# Altium schematic sheet IMU_breakout.SchDoc
size A4
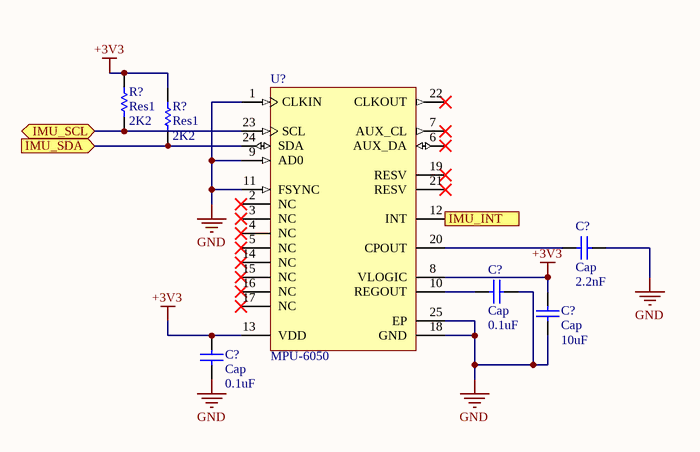
[diagram p0: IMU_breakout.SchDoc]

## Parts
(Parts that share a designator on the sheet are numbered #1, #2 ... from top to bottom, then left to right.)
C?#1  Cap  value 2.2nF  [RAD-0.3]
C?#2  Cap  value 0.1uF  [RAD-0.3]
C?#3  Cap  value 10uF  [RAD-0.3]
C?#4  Cap  value 0.1uF  [RAD-0.3]
R?#1  Res1  value 2K2  [AXIAL-0.3]
R?#2  Res1  value 2K2  [AXIAL-0.3]
U?  MPU-6050  [IS-QFN-24_V]

## Ports
IMU_INT (out), IMU_SCL (bidir), IMU_SDA (in)

## Nets
+3V3: C?#3.2 C?#4.2 R?#1.2 R?#2.2 U?.8(VLOGIC) U?.13(VDD)
GND: C?#1.1 C?#2.1 C?#3.1 C?#4.1 U?.1(CLKIN) U?.9(AD0) U?.11(FSYNC) U?.18(GND) U?.25(EP)
IMU_INT: U?.12(INT) ; port IMU_INT
IMU_SCL: R?#1.1 U?.23(SCL) ; port IMU_SCL
IMU_SDA: R?#2.1 U?.24(SDA) ; port IMU_SDA
NetC?#1_2: C?#1.2 U?.20(CPOUT)
NetC?#2_2: C?#2.2 U?.10(REGOUT)

Not connected (* = marked no-connect by the designer): U? 2(NC)* 3(NC)* 4(NC)* 5(NC)* 6(AUX_DA)* 7(AUX_CL)* 14(NC)* 15(NC)* 16(NC)* 17(NC)* 19(RESV)* 21(RESV)* 22(CLKOUT)*

## Library data of the parts
C?#1-C?#4 = Cap: Capacitor; Published: 8-Jun-2000; LatestRevisionDate: 17-Jul-2002; LatestRevisionNote: Re-released for DXP Platform.; PackageReference: RAD-0.3; Publisher: Altium Limited; PackageDescription: Radial Cap, Thru-Hole; 2 Leads; 0.3 in Pin Spacing
R?#1 R?#2 = Res1: Resistor; Published: 8-Jun-2000; LatestRevisionDate: 17-Jul-2002; LatestRevisionNote: Re-released for DXP Platform.; PackageReference: AXIAL-0.3; Publisher: Altium Limited; PackageDescription: Axial Device, Thru-Hole; 2 Leads; 0.3 in Pin Spacing
U? = CMP-1753-00002-2: 3-Axis Gyroscope, Accelerometer and a Digital Motion Processor(TM) (DMP), 2.375 to 3.46 V, -40 to 85 degC, 24-Pin QFN, RoHS, Tape and Reel; Manufacturer: InvenSense; Featured Product: MPU-60506-Axis,IntegratedI²CSolution; Other Names: 1428-1007-2 / MPU6050; Sensor Type: MotionTracking; Online Catalog: MPU-6000™Series; Unit PriceUSD: Digital; Datasheet Version: Rev. 3.3, 05/2012; Category: Sensors,Transducers; Datasheet URL: http://datasheet.octopart.com/MPU-6050-InvenSense-datasheet-14421344.pdf; Family: Multifunction; Standard Package: 5,000; Manufacturer URL: http://www.invensense.com/; Output Type: Digital; Dynamic Catalog: MPU-6000™Series